# Altium schematic sheet Top Level.SchDoc
size A3; SheetNumber: 1; SheetTotal: 1
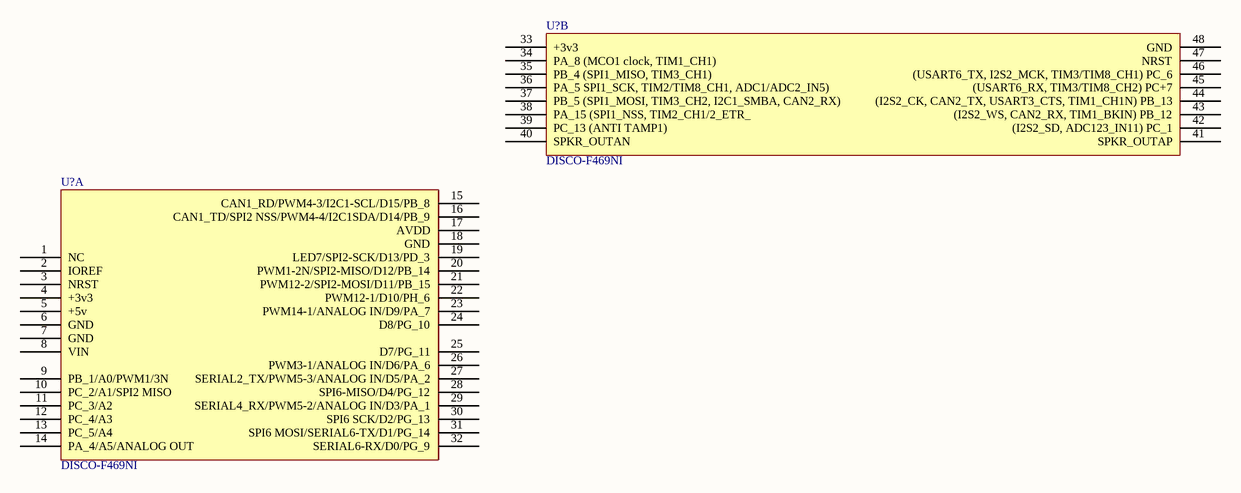
[diagram p0: Top Level.SchDoc]

## Parts
(Parts that share a designator on the sheet are numbered #1, #2 ... from top to bottom, then left to right.)
U?#1  DISCO-F469NI  [DISCO-F469NI]  (part B of 2)
U?#2  DISCO-F469NI  [DISCO-F469NI]  (part A of 2)

## Nets

Not connected (* = marked no-connect by the designer): U?#1 33(+3v3) 34(PA_8_(MCO1_clock,_TIM1_CH1)) 35(PB_4_(SPI1_MISO,_TIM3_CH1)) 36(PA_5_SPI1_SCK,_TIM2/TIM8_CH1,_ADC1/ADC2_IN5)) 37(PB_5_(SPI1_MOSI,_TIM3_CH2,_I2C1_SMBA,_CAN2_RX)) 38(PA_15_(SPI1_NSS,_TIM2_CH1/2_ETR_) 39(PC_13_(ANTI_TAMP1)) 40(SPKR_OUTAN) 41(SPKR_OUTAP) 42((I2S2_SD,_ADC123_IN11)_PC_1) 43((I2S2_WS,_CAN2_RX,_TIM1_BKIN)_PB_12) 44((I2S2_CK,_CAN2_TX,_USART3_CTS,_TIM1_CH1N)_PB_13) 45((USART6_RX,_TIM3/TIM8_CH2)_PC+7) 46((USART6_TX,_I2S2_MCK,_TIM3/TIM8_CH1)_PC_6) 47(NRST) 48(GND); U?#2 1(NC) 2(IOREF) 3(NRST) 4(+3v3) 5(+5v) 6(GND) 7(GND) 8(VIN) 9(PB_1/A0/PWM1/3N) 10(PC_2/A1/SPI2_MISO) 11(PC_3/A2) 12(PC_4/A3) 13(PC_5/A4) 14(PA_4/A5/ANALOG_OUT) 15(CAN1_RD/PWM4-3/I2C1-SCL/D15/PB_8) 16(CAN1_TD/SPI2_NSS/PWM4-4/I2C1SDA/D14/PB_9) 17(AVDD) 18(GND) 19(LED7/SPI2-SCK/D13/PD_3) 20(PWM1-2N/SPI2-MISO/D12/PB_14) 21(PWM12-2/SPI2-MOSI/D11/PB_15) 22(PWM12-1/D10/PH_6) 23(PWM14-1/ANALOG_IN/D9/PA_7) 24(D8/PG_10) 25(D7/PG_11) 26(PWM3-1/ANALOG_IN/D6/PA_6) 27(SERIAL2_TX/PWM5-3/ANALOG_IN/D5/PA_2) 28(SPI6-MISO/D4/PG_12) 29(SERIAL4_RX/PWM5-2/ANALOG_IN/D3/PA_1) 30(SPI6_SCK/D2/PG_13) 31(SPI6_MOSI/SERIAL6-TX/D1/PG_14) 32(SERIAL6-RX/D0/PG_9)

## Library data of the parts
U?#1 U?#2 = CMP-021-000011-1: STM32F469 Discovery STM32F4 ARM® Cortex®-M4 MCU 32-Bit Embedded Evaluation Board  (The Disco 69 lol); Part Number: DISCO-F469NI